# EasyEDA schematic SCH_Schema_Line_Follower_2_2023-12-11.json
TITLE: Line Follower; REV: 1.0; Date: 2023-12-07; Sheet: 1/1; Company: HoGent
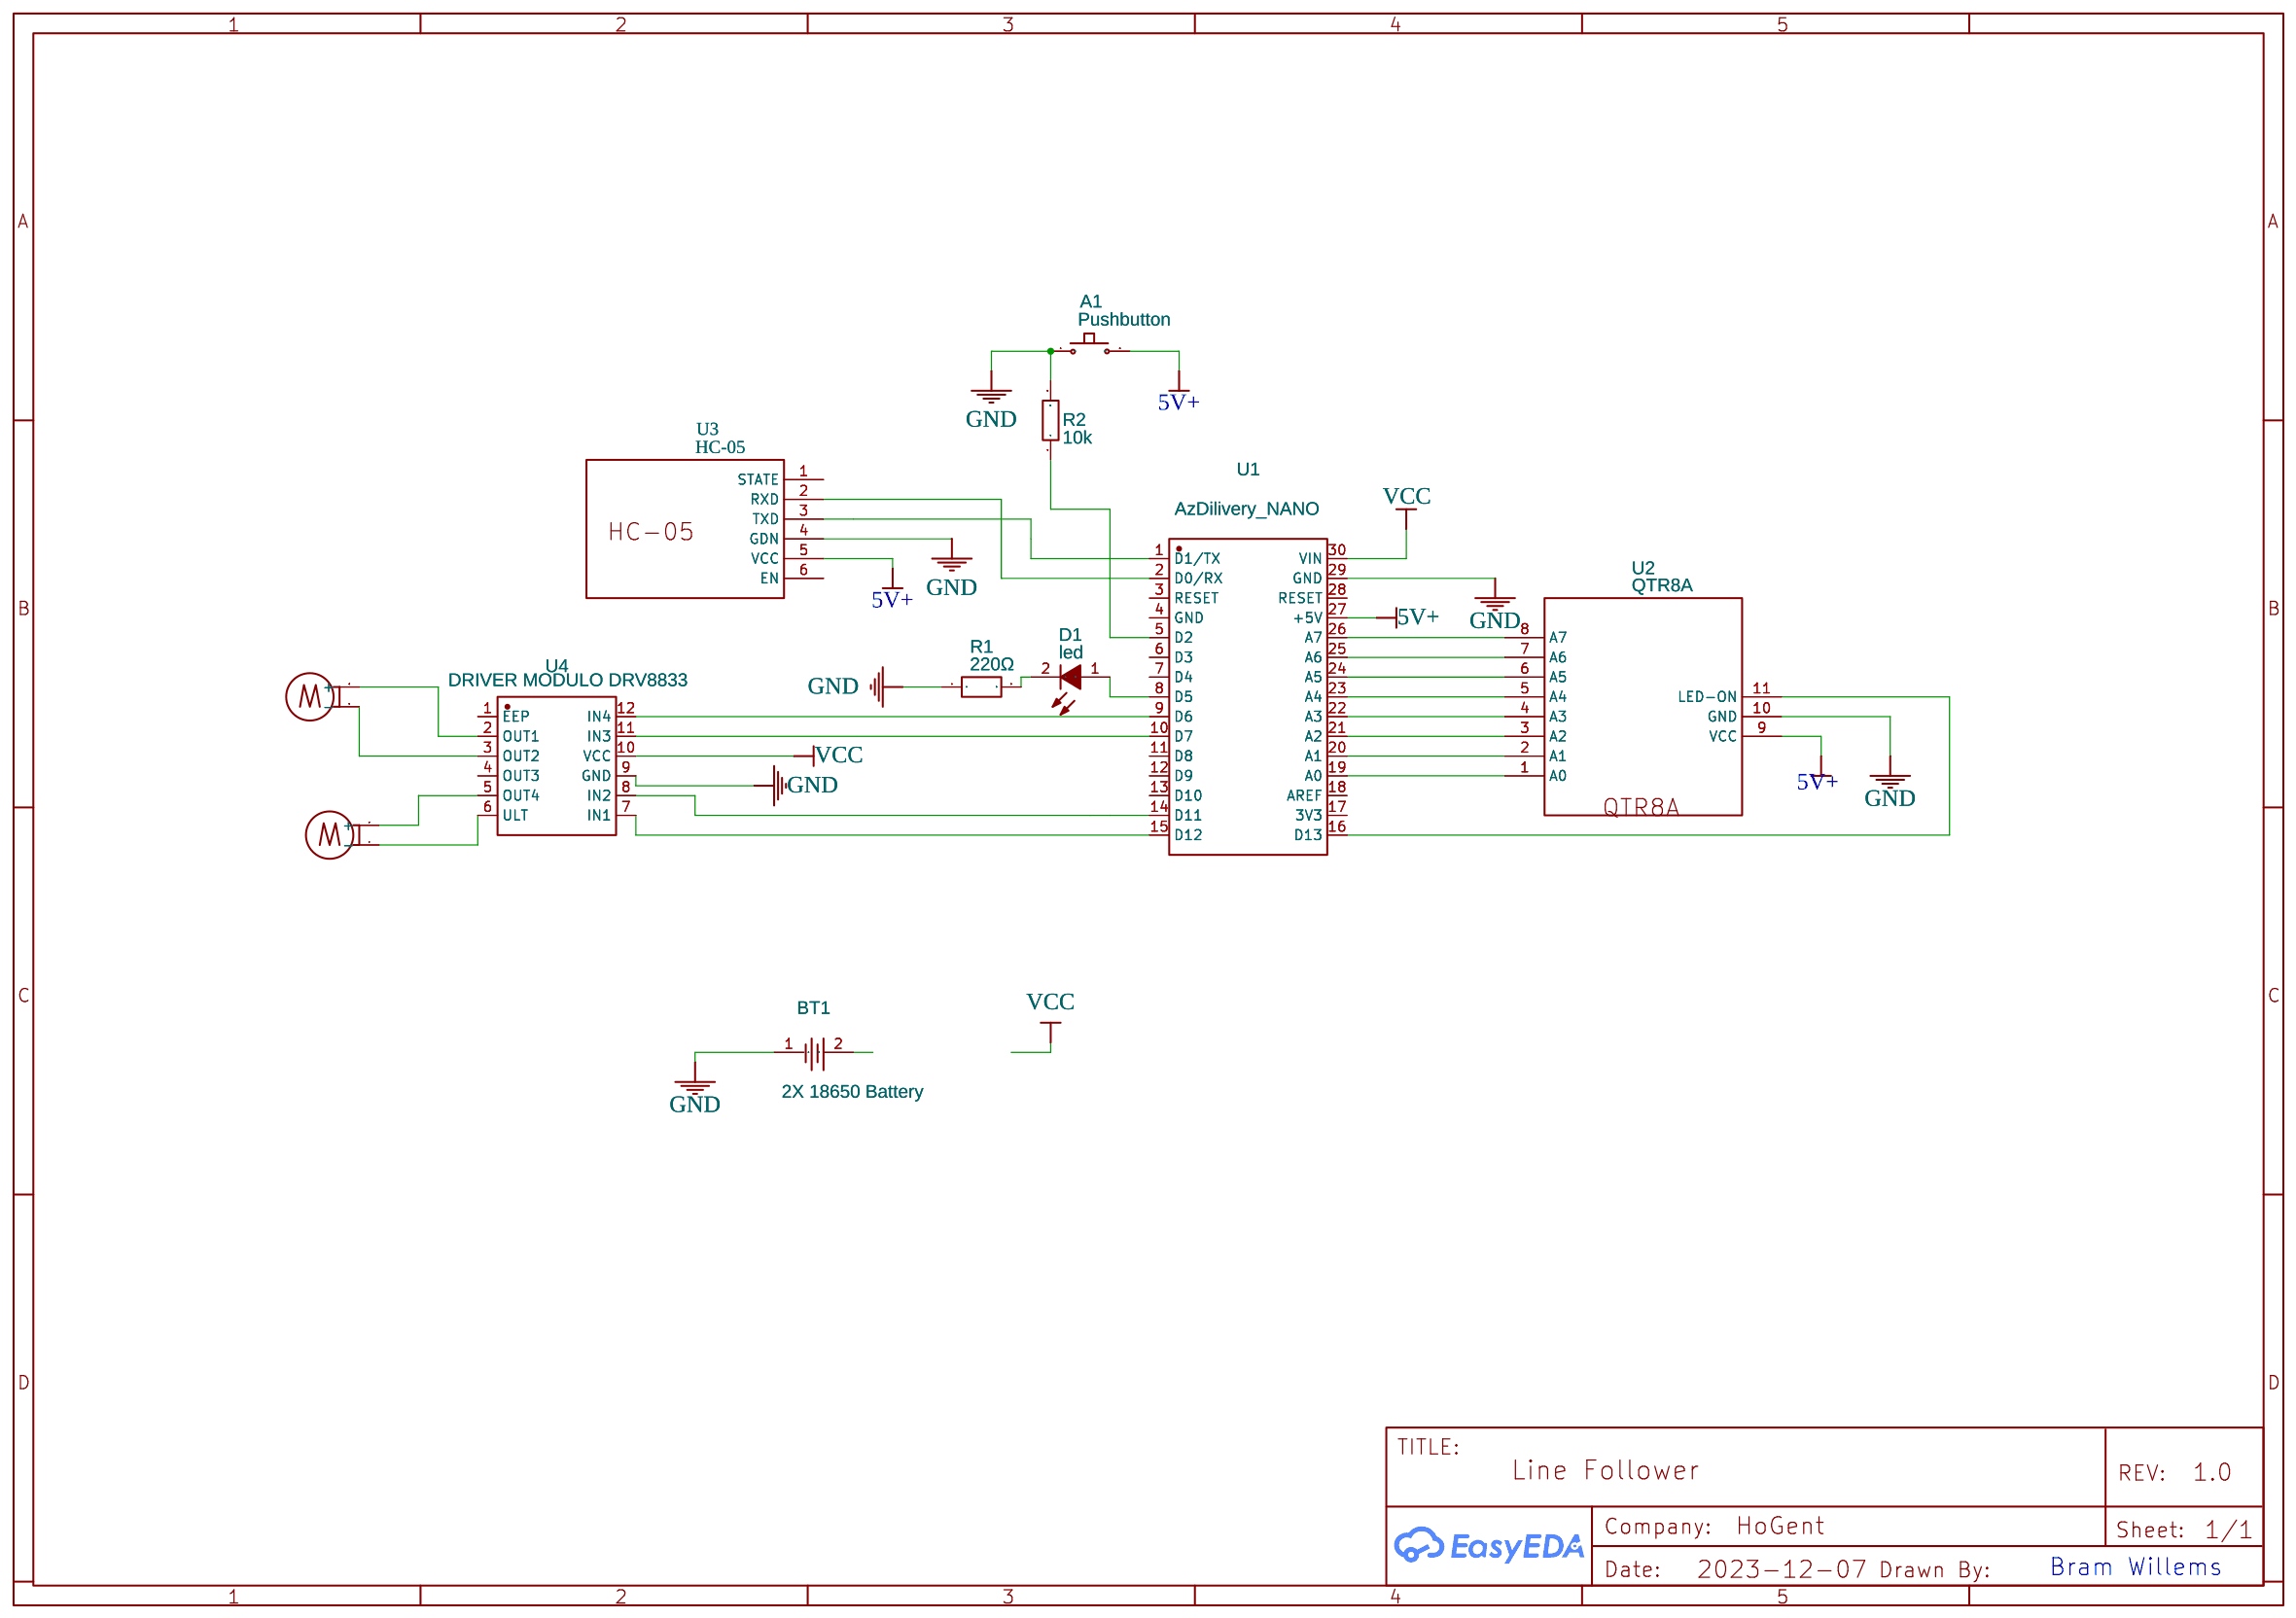
[diagram p0: schematic sheet]

## Parts
A1  Pushbutton
BT1  2X 18650 Battery  [BAT-TH_BH-18650-A1AJ006]
D1  led  [LED-TH_LED-DP2-2LED]
MQT1  LCM1234A3523F  [VIBRATING-MOTOR-SMD_WELDING]
MQT2  LCM1234A3523F  [VIBRATING-MOTOR-SMD_WELDING]
R1  220Ω  [AXIAL RESISTOR 220 OHM - TH_BD2.3-L6.0-P10.00-D0.4]
R2  10k  [R1206 - 10K OHM - RNCP1206FTD10K0]
U1  AzDilivery_NANO  [COMM-TH_ARDUINO_NANO]
U2  QTR8A  [QTR8A]
U3  HC-05  [3333]
U4  DRIVER MODULO DRV8833  [DRV8833]

## Library data of the parts
A1 = Ammeter: sourceId: 9j75heOMm
BT1 = BH-18650-A1AJ006: Supplier: LCSC; Supplier Part: C5290175; Manufacturer: MYOUNG(美阳); JLCPCB Part Class: Extended Part; Contributor: lcsc; link: https://lcsc.com/eda_search?q=C5290175&%26type=1&ref=editor
D1 = 3MM GREEN TH LED 5600 COPY: Supplier: Digi-Key; Manufacturer: VccLite; Manufacturer Part: 5600; Supplier Part: L20325-ND; link: https://vcclite.com/product/5602f5-5v/; Contributor: pacs170106
MQT1 MQT2 = LCM1234A3523F: Supplier: LCSC; Supplier Part: C7424783; Manufacturer: LEADER(立得); Contributor: lcsc; link: https://lcsc.com/eda_search?q=C7424783&%26type=1&ref=editor
R1 = AXIAL RESISTOR 220 OHM - TH_BD2.3-L6.0-P10.00-D0.4: Contributor: Waleed Kies; JLCPCB Part Class: Extended Part
R2 = RNCP1206FTD10K0: Supplier: LCSC; link: https://www.digikey.in/en/products/detail/stackpole-electronics-inc/RNCP1206FTD10K0/2240370; Contributor: MansiTayade
U1 = ARDUINO_NANO: Contributor: lcsc; Supplier: LCSC; Supplier Part: C9900017879; Manufacturer: null; JLCPCB Part Class: Extended Part; link: https://lcsc.com/eda_search?q=C9900017879&%26type=1&ref=editor
U2 = QTR8A: Manufacturer: POLOLU; Supplier: POLOLU; link: https://www.pololu.com/product/960/pictures; Contributor: Gustavo Isola
U4 = DRIVER MODULO DRV8833: Contributor: hoangdx

## Nets
5V+: A1.2 U1.27(+5V) U2.9(VCC) U3.5(VCC)
GND: A1.1(+) BT1.1 R1.1 R2.2 U1.29(GND) U2.10(GND) U3.4(GDN) U4.9(GND)
VCC: U1.30(VIN) U4.10(VCC)
Net-(D1-1): D1.1(A) U1.8(D5)
Net-(D1-2): D1.2(K) R1.2
Net-(MQT1-1): MQT1.1(-) U4.3(OUT2)
Net-(MQT1-2): MQT1.2(+) U4.2(OUT1)
Net-(MQT2-1): MQT2.1(-) U4.6(ULT)
Net-(MQT2-2): MQT2.2(+) U4.5(OUT4)
Net-(R2-1): R2.1 U1.5(D2)
Net-(U1-1): U1.1(D1/TX) U3.3(TXD)
Net-(U1-2): U1.2(D0/RX) U3.2(RXD)
Net-(U1-9): U1.9(D6) U4.12(IN4)
Net-(U1-10): U1.10(D7) U4.11(IN3)
Net-(U1-14): U1.14(D11) U4.8(IN2)
Net-(U1-15): U1.15(D12) U4.7(IN1)
Net-(U1-16): U1.16(D13) U2.11(LED-ON)
Net-(U1-19): U1.19(A0) U2.1(A0)
Net-(U1-20): U1.20(A1) U2.2(A1)
Net-(U1-21): U1.21(A2) U2.3(A2)
Net-(U1-22): U1.22(A3) U2.4(A3)
Net-(U1-23): U1.23(A4) U2.5(A4)
Net-(U1-24): U1.24(A5) U2.6(A5)
Net-(U1-25): U1.25(A6) U2.7(A6)
Net-(U1-26): U1.26(A7) U2.8(A7)

Not connected (* = marked no-connect by the designer): BT1 2; U1 3(RESET) 4(GND) 6(D3) 7(D4) 11(D8) 12(D9) 13(D10) 17(3V3) 18(AREF) 28(RESET); U3 1(STATE) 6(EN); U4 1(EEP) 4(OUT3)

## Notes on the sheet
- Bram Willems
